# Altium project DAQ_Replacement.PrjPcb (part 1 of 3)
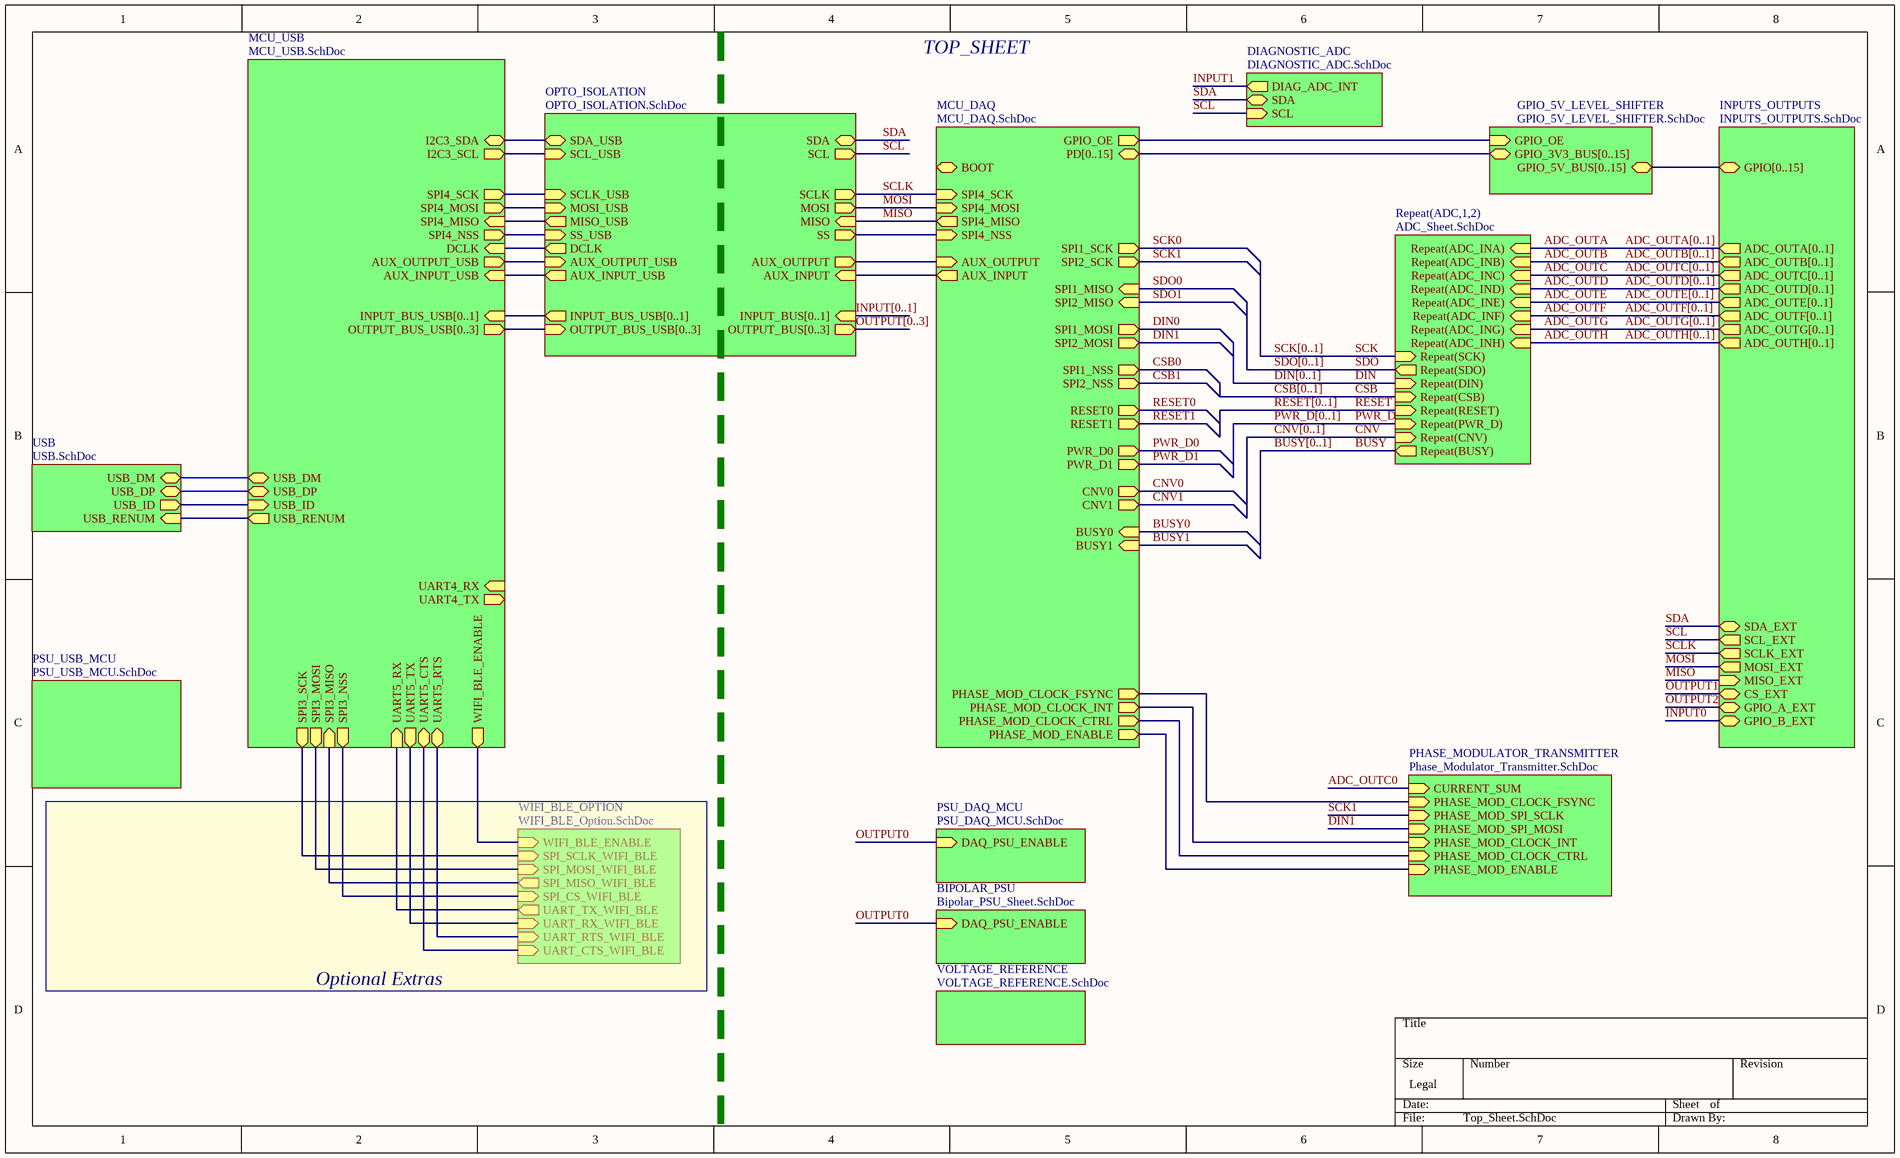
[diagram p0: Top_Sheet.SchDoc]
16 sheets, 448 parts. Net scope: hierarchical (ports join the sheet entries above them; power ports are global).
Board file: DAQ_Replacement.PcbDoc
Sheets:
  Top_Sheet.SchDoc
    USB = USB.SchDoc
    ADC1 = ADC_Sheet.SchDoc
      ADC_INPUT_FILTER = ADC_INPUT_FILTER.SchDoc
    ADC2 = ADC_Sheet.SchDoc
      ADC_INPUT_FILTER = ADC_INPUT_FILTER.SchDoc
    OPTO_ISOLATION = OPTO_ISOLATION.SchDoc
    BIPOLAR_PSU = Bipolar_PSU_Sheet.SchDoc
    WIFI_BLE_OPTION = WIFI_BLE_Option.SchDoc
    DIAGNOSTIC_ADC = DIAGNOSTIC_ADC.SchDoc
    MCU_DAQ = MCU_DAQ.SchDoc
    MCU_USB = MCU_USB.SchDoc
    PHASE_MODULATOR_TRANSMITTER = Phase_Modulator_Transmitter.SchDoc
    INPUTS_OUTPUTS = INPUTS_OUTPUTS.SchDoc
    GPIO_5V_LEVEL_SHIFTER = GPIO_5V_LEVEL_SHIFTER.SchDoc
    VOLTAGE_REFERENCE = VOLTAGE_REFERENCE.SchDoc
    PSU_USB_MCU = PSU_USB_MCU.SchDoc
    PSU_DAQ_MCU = PSU_DAQ_MCU.SchDoc

## Sheet Top_Sheet.SchDoc
size Legal

### Sub-sheets
BIPOLAR_PSU = Bipolar_PSU_Sheet.SchDoc: DAQ_PSU_ENABLE (in)
DIAGNOSTIC_ADC = DIAGNOSTIC_ADC.SchDoc: SCL (in), SDA (bidir), DIAG_ADC_INT (out)
GPIO_5V_LEVEL_SHIFTER = GPIO_5V_LEVEL_SHIFTER.SchDoc: GPIO_OE (in), GPIO_3V3_BUS[0..15] (bidir), GPIO_5V_BUS[0..15] (bidir)
INPUTS_OUTPUTS = INPUTS_OUTPUTS.SchDoc: SDA_EXT (bidir), SCL_EXT (out), SCLK_EXT (out), MOSI_EXT (out), MISO_EXT (in), GPIO_B_EXT, GPIO_A_EXT, GPIO[0..15] (bidir), CS_EXT, ADC_OUTA[0..1] (out), ADC_OUTB[0..1] (out), ADC_OUTC[0..1] (out), ADC_OUTD[0..1] (out), ADC_OUTE[0..1] (out), ADC_OUTF[0..1] (out), ADC_OUTG[0..1] (out), ADC_OUTH[0..1] (out)
MCU_DAQ = MCU_DAQ.SchDoc: BOOT, SPI4_NSS (in), SPI4_SCK (in), SPI4_MISO (out), SPI4_MOSI (in), SPI1_NSS (out), SPI1_SCK (out), SPI1_MISO (in), SPI1_MOSI (out), SPI2_NSS (out), SPI2_SCK (out), SPI2_MISO (in), SPI2_MOSI (out), PD[0..15] (bidir), CNV0 (out), RESET0 (out), BUSY0 (in), CNV1 (out), RESET1 (out), BUSY1 (in), PHASE_MOD_CLOCK_FSYNC (out), PHASE_MOD_CLOCK_INT (out), PHASE_MOD_CLOCK_CTRL (out), PHASE_MOD_ENABLE (out), AUX_INPUT (out), AUX_OUTPUT (in), GPIO_OE (out), PWR_D0 (out), PWR_D1 (out)
MCU_USB = MCU_USB.SchDoc: USB_ID (in), USB_RENUM (out), WIFI_BLE_ENABLE (out), DCLK (in), AUX_OUTPUT_USB (out), AUX_INPUT_USB (in), USB_DP (bidir), USB_DM (bidir), SPI4_NSS (out), SPI4_SCK (out), SPI4_MISO (in), SPI4_MOSI (out), UART5_CTS (bidir), UART5_RTS (bidir), SPI3_MOSI (out), SPI3_MISO (in), SPI3_NSS (out), SPI3_SCK (out), UART4_RX (in), UART4_TX (out), UART5_RX (in), UART5_TX (out), I2C3_SDA (bidir), I2C3_SCL (out), INPUT_BUS_USB[0..1] (in), OUTPUT_BUS_USB[0..3] (out)
OPTO_ISOLATION = OPTO_ISOLATION.SchDoc: SCL_USB (in), SDA_USB (bidir), SDA (bidir), SCLK_USB (in), MOSI_USB (in), MISO_USB (out), MISO (in), SS_USB (in), SS (out), DCLK (out), AUX_OUTPUT_USB (in), AUX_OUTPUT (out), AUX_INPUT_USB (out), AUX_INPUT (in), INPUT_BUS_USB[0..1] (out), OUTPUT_BUS_USB[0..3] (in), INPUT_BUS[0..1] (in), OUTPUT_BUS[0..3] (out), SCLK (out), MOSI (out), SCL (out)
PHASE_MODULATOR_TRANSMITTER = Phase_Modulator_Transmitter.SchDoc: CURRENT_SUM (in), PHASE_MOD_CLOCK_FSYNC (in), PHASE_MOD_SPI_SCLK (in), PHASE_MOD_SPI_MOSI (in), PHASE_MOD_ENABLE (in), PHASE_MOD_CLOCK_INT (in), PHASE_MOD_CLOCK_CTRL (in)
PSU_DAQ_MCU = PSU_DAQ_MCU.SchDoc: DAQ_PSU_ENABLE (in)
PSU_USB_MCU = PSU_USB_MCU.SchDoc: no entries
Repeat(ADC,1,2) = ADC_Sheet.SchDoc: Repeat(SCK) (in), Repeat(SDO) (out), Repeat(DIN) (in), Repeat(CNV) (in), Repeat(RESET) (in), Repeat(PWR_D) (in), Repeat(CSB) (in), Repeat(BUSY) (out), Repeat(ADC_INF) (in), Repeat(ADC_INB) (in), Repeat(ADC_INH) (in), Repeat(ADC_INC) (in), Repeat(ADC_INA) (in), Repeat(ADC_INE) (in), Repeat(ADC_IND) (in), Repeat(ADC_ING) (in)
USB = USB.SchDoc: USB_DM (bidir), USB_DP (bidir), USB_ID (out), USB_RENUM (in)
VOLTAGE_REFERENCE = VOLTAGE_REFERENCE.SchDoc: no entries
WIFI_BLE_OPTION = WIFI_BLE_Option.SchDoc: SPI_CS_WIFI_BLE (in), SPI_MOSI_WIFI_BLE (in), SPI_MISO_WIFI_BLE (out), SPI_SCLK_WIFI_BLE (in), UART_RX_WIFI_BLE (in), UART_TX_WIFI_BLE (out), UART_RTS_WIFI_BLE (in), UART_CTS_WIFI_BLE (in), WIFI_BLE_ENABLE (in)

### Nets
ADC_OUTA: sheet Repeat(ADC,1,2)/Repeat(ADC_INA)
ADC_OUTB: sheet Repeat(ADC,1,2)/Repeat(ADC_INB)
ADC_OUTC: sheet Repeat(ADC,1,2)/Repeat(ADC_INC)
ADC_OUTD: sheet Repeat(ADC,1,2)/Repeat(ADC_IND)
ADC_OUTE: sheet Repeat(ADC,1,2)/Repeat(ADC_INE)
ADC_OUTF: sheet Repeat(ADC,1,2)/Repeat(ADC_INF)
ADC_OUTG: sheet Repeat(ADC,1,2)/Repeat(ADC_ING)
ADC_OUTH: sheet Repeat(ADC,1,2)/Repeat(ADC_INH)
BUSY: sheet Repeat(ADC,1,2)/Repeat(BUSY)
CNV: sheet Repeat(ADC,1,2)/Repeat(CNV)
CSB: sheet Repeat(ADC,1,2)/Repeat(CSB)
DIN: sheet Repeat(ADC,1,2)/Repeat(DIN)
DIN1: sheet MCU_DAQ/SPI2_MOSI, sheet PHASE_MODULATOR_TRANSMITTER/PHASE_MOD_SPI_MOSI  [project net DIN]
GPIO_OE: sheet MCU_DAQ/GPIO_OE, sheet GPIO_5V_LEVEL_SHIFTER/GPIO_OE
I2C3_SCL: sheet OPTO_ISOLATION/SCL_USB, sheet MCU_USB/I2C3_SCL
I2C3_SDA: sheet OPTO_ISOLATION/SDA_USB, sheet MCU_USB/I2C3_SDA
MISO: sheet OPTO_ISOLATION/MISO, sheet MCU_DAQ/SPI4_MISO, sheet INPUTS_OUTPUTS/MISO_EXT
MOSI: sheet OPTO_ISOLATION/MOSI, sheet MCU_DAQ/SPI4_MOSI, sheet INPUTS_OUTPUTS/MOSI_EXT
OUTPUT0: sheet BIPOLAR_PSU/DAQ_PSU_ENABLE, sheet PSU_DAQ_MCU/DAQ_PSU_ENABLE  [project net DAQ_PSU_ENABLE]
PC0: sheet MCU_DAQ/PHASE_MOD_CLOCK_CTRL, sheet PHASE_MODULATOR_TRANSMITTER/PHASE_MOD_CLOCK_CTRL
PC1: sheet MCU_DAQ/PHASE_MOD_CLOCK_INT, sheet PHASE_MODULATOR_TRANSMITTER/PHASE_MOD_CLOCK_INT
PC2: sheet MCU_DAQ/PHASE_MOD_ENABLE, sheet PHASE_MODULATOR_TRANSMITTER/PHASE_MOD_ENABLE
PC3: sheet MCU_DAQ/PHASE_MOD_CLOCK_FSYNC, sheet PHASE_MODULATOR_TRANSMITTER/PHASE_MOD_CLOCK_FSYNC
PE8: sheet OPTO_ISOLATION/AUX_INPUT, sheet MCU_DAQ/AUX_INPUT
PE9: sheet OPTO_ISOLATION/AUX_OUTPUT, sheet MCU_DAQ/AUX_OUTPUT
PE11: sheet OPTO_ISOLATION/SS, sheet MCU_DAQ/SPI4_NSS
PWR_D: sheet Repeat(ADC,1,2)/Repeat(PWR_D)
RESET: sheet Repeat(ADC,1,2)/Repeat(RESET)
SCK: sheet Repeat(ADC,1,2)/Repeat(SCK)
SCK1: sheet MCU_DAQ/SPI2_SCK, sheet PHASE_MODULATOR_TRANSMITTER/PHASE_MOD_SPI_SCLK  [project net PB13]
SCL: sheet OPTO_ISOLATION/SCL, sheet DIAGNOSTIC_ADC/SCL, sheet INPUTS_OUTPUTS/SCL_EXT
SCLK: sheet OPTO_ISOLATION/SCLK, sheet MCU_DAQ/SPI4_SCK, sheet INPUTS_OUTPUTS/SCLK_EXT  [project net PE12]
SDA: sheet OPTO_ISOLATION/SDA, sheet DIAGNOSTIC_ADC/SDA, sheet INPUTS_OUTPUTS/SDA_EXT
SDO: sheet Repeat(ADC,1,2)/Repeat(SDO)
SPI_CS_WIFI_BLE: sheet WIFI_BLE_OPTION/SPI_CS_WIFI_BLE, sheet MCU_USB/SPI3_NSS
SPI_MISO_WIFI_BLE: sheet WIFI_BLE_OPTION/SPI_MISO_WIFI_BLE, sheet MCU_USB/SPI3_MISO
SPI_MOSI_WIFI_BLE: sheet WIFI_BLE_OPTION/SPI_MOSI_WIFI_BLE, sheet MCU_USB/SPI3_MOSI
SPI_SCLK_WIFI_BLE: sheet WIFI_BLE_OPTION/SPI_SCLK_WIFI_BLE, sheet MCU_USB/SPI3_SCK
UART_CTS_WIFI_BLE: sheet WIFI_BLE_OPTION/UART_CTS_WIFI_BLE, sheet MCU_USB/UART5_CTS
UART_RTS_WIFI_BLE: sheet WIFI_BLE_OPTION/UART_RTS_WIFI_BLE, sheet MCU_USB/UART5_RTS
UART_RX_WIFI_BLE: sheet WIFI_BLE_OPTION/UART_RX_WIFI_BLE, sheet MCU_USB/UART5_TX
UART_TX_WIFI_BLE: sheet WIFI_BLE_OPTION/UART_TX_WIFI_BLE, sheet MCU_USB/UART5_RX
USB_ID: sheet USB/USB_ID, sheet MCU_USB/USB_ID
USB_RENUM: sheet USB/USB_RENUM, sheet MCU_USB/USB_RENUM
WIFI_BLE_ENABLE: sheet WIFI_BLE_OPTION/WIFI_BLE_ENABLE, sheet MCU_USB/WIFI_BLE_ENABLE
NetJ4_2: sheet USB/USB_DM, sheet MCU_USB/USB_DM
NetJ4_3: sheet USB/USB_DP, sheet MCU_USB/USB_DP
NetU14_40: sheet OPTO_ISOLATION/DCLK, sheet MCU_USB/DCLK
NetU14_42: sheet OPTO_ISOLATION/SS_USB, sheet MCU_USB/SPI4_NSS
NetU14_43: sheet OPTO_ISOLATION/SCLK_USB, sheet MCU_USB/SPI4_SCK
NetU14_44: sheet OPTO_ISOLATION/MISO_USB, sheet MCU_USB/SPI4_MISO
NetU14_45: sheet OPTO_ISOLATION/MOSI_USB, sheet MCU_USB/SPI4_MOSI
NetU14_95: sheet OPTO_ISOLATION/AUX_OUTPUT_USB, sheet MCU_USB/AUX_OUTPUT_USB
NetU14_96: sheet OPTO_ISOLATION/AUX_INPUT_USB, sheet MCU_USB/AUX_INPUT_USB

### Buses and harness runs
bus ADC_OUTA[0..1] = sheet INPUTS_OUTPUTS/ADC_OUTA[0..1]
bus ADC_OUTB[0..1] = sheet INPUTS_OUTPUTS/ADC_OUTB[0..1]
bus ADC_OUTC[0..1] = sheet INPUTS_OUTPUTS/ADC_OUTC[0..1]
bus ADC_OUTD[0..1] = sheet INPUTS_OUTPUTS/ADC_OUTD[0..1]
bus ADC_OUTE[0..1] = sheet INPUTS_OUTPUTS/ADC_OUTE[0..1]
bus ADC_OUTF[0..1] = sheet INPUTS_OUTPUTS/ADC_OUTF[0..1]
bus ADC_OUTG[0..1] = sheet INPUTS_OUTPUTS/ADC_OUTG[0..1]
bus ADC_OUTH[0..1] = sheet INPUTS_OUTPUTS/ADC_OUTH[0..1]
bus BUSY[0..1]
bus CNV[0..1]
bus CSB[0..1]
bus DIN[0..1]
bus INPUT[0..1] = sheet OPTO_ISOLATION/INPUT_BUS[0..1]
bus OUTPUT[0..3] = sheet OPTO_ISOLATION/OUTPUT_BUS[0..3]
bus PWR_D[0..1]
bus RESET[0..1]
bus SCK[0..1]
bus SDO[0..1]
bus sheet GPIO_5V_LEVEL_SHIFTER/GPIO_3V3_BUS[0..15] = sheet MCU_DAQ/PD[0..15]
bus sheet GPIO_5V_LEVEL_SHIFTER/GPIO_5V_BUS[0..15] = sheet INPUTS_OUTPUTS/GPIO[0..15]
bus sheet MCU_USB/INPUT_BUS_USB[0..1] = sheet OPTO_ISOLATION/INPUT_BUS_USB[0..1]
bus sheet MCU_USB/OUTPUT_BUS_USB[0..3] = sheet OPTO_ISOLATION/OUTPUT_BUS_USB[0..3]

### Notes on the sheet
- TOP_SHEET
- Optional Extras

## Sheet USB.SchDoc: USB
size A4; DocumentNumber: MB1137; Revision: B-01; SheetNumber: 4; SheetTotal: 6; Project: NUCLEO-XXXXZX
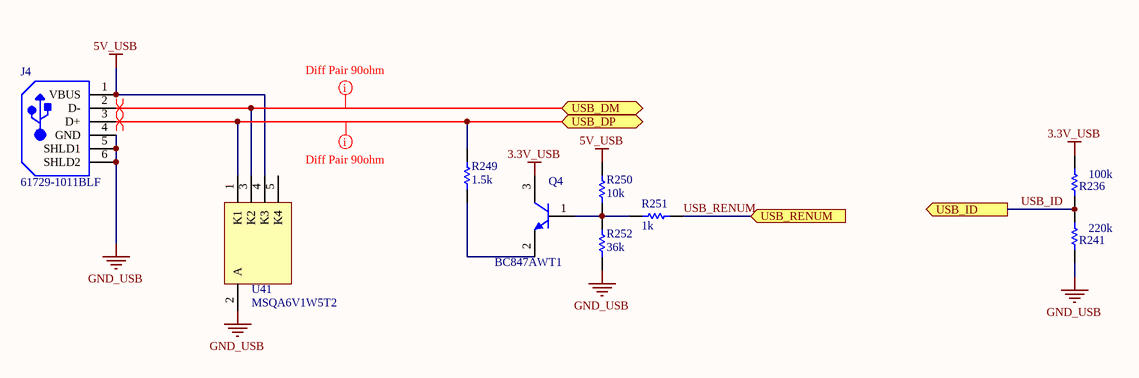
[diagram p1: USB.SchDoc]

### Parts
J4  61729-1011BLF  [FCI-61729-1011BLF_V]
Q4  BC847AWT1  [ONSC-SC-70-3-419-04_V]
R236  value 100k  [RESC0402(1005)_L]  (hidden comment: RES0402)
R241  value 220k  [RESC0402(1005)_L]  (hidden comment: RES0402)
R249  value 1.5k  [RESC0402(1005)_L]  (hidden comment: RES0402)
R250  value 10k  [RESC0402(1005)_L]  (hidden comment: RES0402)
R251  value 1k  [RESC0402(1005)_L]  (hidden comment: RES0402)
R252  value 36k  [RESC0402(1005)_L]  (hidden comment: RES0402)
U41  MSQA6V1W5T2  [ONSC-SC70-5-419A-02_V]

### Ports
USB_DM (bidir), USB_DP (bidir), USB_ID (out), USB_RENUM (in)

### Nets
3.3V_USB: Q4.3(C) R236.2
5V_USB: J4.1(VBUS) R250.1 U41.4(K3)
GND_USB: J4.4(GND) J4.5(SHLD1) J4.6(SHLD2) R241.1 R252.2 U41.2(A)
USB_ID: R236.1 R241.2 ; port USB_ID
USB_RENUM: R251.2 ; port USB_RENUM
NetJ4_2: J4.2(D-) U41.3(K2) ; port USB_DM
NetJ4_3: J4.3(D+) R249.1 U41.1(K1) ; port USB_DP
NetQ4_1: Q4.1(B) R250.2 R251.1 R252.1
NetQ4_2: Q4.2(E) R249.2

Not connected (* = marked no-connect by the designer): U41 5(K4)

### Layout directives
differential pair: (no net found under the mark)
mark named Diff Pair 90ohm: NetJ4_2, NetJ4_3

### Notes on the sheet
- Title:
- Project:
- Size:
- Date:
- A4
- Reference:
- Sheet:
- Revision:
- of

### Library data of the parts
J4 = CMP-1698-00004-1: USB Receptacle B Type, Right Angle, -40 to 85 degC, 4-Pin THD, RoHS, Tube; Voltage Rating (DC): 100 V; Case\Package: Radial; Capacitance: 22 uF; Tolerance: 20%; ComponentLink2Description: Datasheet; Lead Pitch: 2.5 mm; Packaging: Bulk; REACH SVHC: No SVHC; Length: 11.2 mm; Pins: 2; Radiation Hardening: No; RoHSCompliant: true; ComponentLink1Description: Manufacturer URL; Voltage Rating: 100 V; Min Operating Temperature: -40 degC; PackageDescription: 4-Pin Through Hole Device, Body 16 x 12.2 mm; Height: 11.2 mm; PackageReference: 61729-1011BLF; Package Quantity: 200; ComponentLink2URL: http://portal.fciconnect.com/Comergent/fci/drawing/61729.pdf; DatasheetVersion: Rev. W, 05/2014; Max Operating Temperature: 85 degC; Diameter: 6.3 mm; ComponentLink1URL: http://portal.fciconnect.com/; Mount: Through Hole
Q4 = CMP-1048-00334-1: General Purpose Transistor, NPN Silicon, 3-Pin SC70, Tape and Reel; Manufacturer: On Semiconductor; Note1: 0; fT Min (MHz): 100; IC Continuous (A): 0.1; PackageDescription: 3-Pin Small Outline Transistor, Body 2 x 1.25 mm, Pitch 0.65 mm; ComponentLink1Description: Manufacturer URL; ComponentLink2Description: Datasheet; ComponentLink1URL: http://www.onsemi.com/; ComponentLink2URL: http://www.onsemi.cn/pub_link/Collateral/BC846AWT1-D.PDF; Packing: Tape and Reel; DatasheetVersion: Rev. 9; Mounting Technology: Surface Mount; PartNumber: BC847AWT1; PackageVersion: Rev. N, 11/2008; RoHS: FALSE; ComponentLink3URL: http://www.onsemi.cn/pub_link/Collateral/419-04.PDF; Polarity: NPN; PackageReference: SC-70-3-419-04; ComponentLink3Description: Package Specification
R236 R241 R249-R252 = CMP-1591-00004-1: 0402 (1005 Metric) Chip Resistor; Case-EIA: 0402; Case-Metric: 1005; PackageReference: RESC0402(1005)
U41 = CMP-1060-00060-1: Quad Array ESD Protection Diodes with Low Clamping Voltage, 5-Pin SC70, Tape and Reel; Manufacturer: On Semiconductor; P Max (W): 0.385; Packing: Tape and Reel; DatasheetVersion: Rev. 7; ComponentLink2URL: http://www.onsemi.com/pub_link/Collateral/MSQA6V1W5T2-D.PDF; PackageDescription: 5-Pin Small Outline Transistor, Body 2 x 1.25 mm, Pitch 0.65 mm; PackageVersion: Rev. L, 01/2013; ComponentLink1URL: http://www.onsemi.com/; ComponentLink2Description: Datasheet; ComponentLink3Description: Package Specification; Mounting Technology: Surface Mount; ComponentLink1Description: Manufacturer URL; PackageReference: SC70-5-419A-02; PartNumber: MSQA6V1W5T2; ComponentLink3URL: http://www.onsemi.cn/pub_link/Collateral/419A-02.PDF

## Sheet ADC_Sheet.SchDoc
size A4
Used 2 times, as channels ADC1, ADC2. Parts and nets are listed once, with the designators drawn on the sheet.
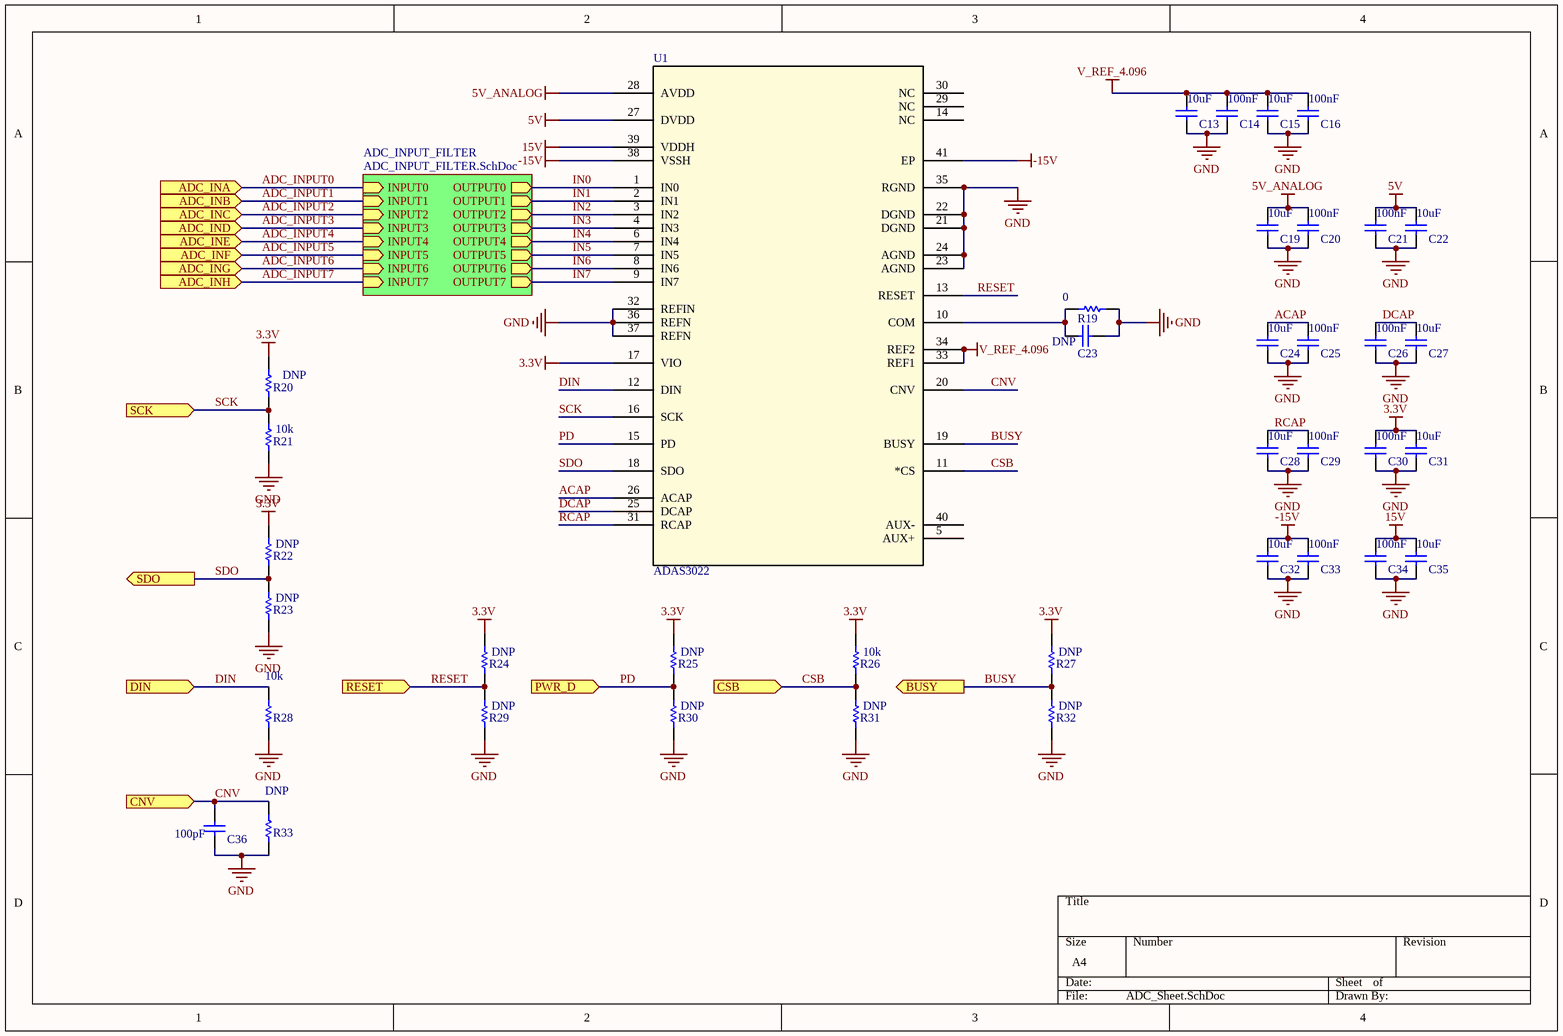
[diagram p2: ADC_Sheet.SchDoc]

### Parts
C13  value 10uF  [CAPC0805(2012)145_L]  (hidden comment: CAP0805)
C14  value 100nF  [CAPC0402(1005)60_L]  (hidden comment: CAP0402)
C15  value 10uF  [CAPC0805(2012)145_L]  (hidden comment: CAP0805)
C16  value 100nF  [CAPC0402(1005)60_L]  (hidden comment: CAP0402)
C19  value 10uF  [CAPC0805(2012)145_L]  (hidden comment: CAP0805)
C20  value 100nF  [CAPC0402(1005)60_L]  (hidden comment: CAP0402)
C21  value 100nF  [CAPC0402(1005)60_L]  (hidden comment: CAP0402)
C22  value 10uF  [CAPC0805(2012)145_L]  (hidden comment: CAP0805)
C23  value DNP  [CAPC0402(1005)60_L]  (hidden comment: CAP0402)
C24  value 10uF  [CAPC0805(2012)145_L]  (hidden comment: CAP0805)
C25  value 100nF  [CAPC0402(1005)60_L]  (hidden comment: CAP0402)
C26  value 100nF  [CAPC0402(1005)60_L]  (hidden comment: CAP0402)
C27  value 10uF  [CAPC0805(2012)145_L]  (hidden comment: CAP0805)
C28  value 10uF  [CAPC0805(2012)145_L]  (hidden comment: CAP0805)
C29  value 100nF  [CAPC0402(1005)60_L]  (hidden comment: CAP0402)
C30  value 100nF  [CAPC0402(1005)60_L]  (hidden comment: CAP0402)
C31  value 10uF  [CAPC0805(2012)145_L]  (hidden comment: CAP0805)
C32  value 10uF  [CAPC0805(2012)145_L]  (hidden comment: CAP0805)
C33  value 100nF  [CAPC0402(1005)60_L]  (hidden comment: CAP0402)
C34  value 100nF  [CAPC0402(1005)60_L]  (hidden comment: CAP0402)
C35  value 10uF  [CAPC0805(2012)145_L]  (hidden comment: CAP0805)
C36  value 100pF  [CAPC0402(1005)60_L]  (hidden comment: CAP0402)
R19  value 0  [RESC0402(1005)_L]  (hidden comment: RES0402)
R20  value DNP  [RESC0402(1005)_L]  (hidden comment: RES0402)
R21  value 10k  [RESC0402(1005)_L]  (hidden comment: RES0402)
R22  value DNP  [RESC0402(1005)_L]  (hidden comment: RES0402)
R23  value DNP  [RESC0402(1005)_L]  (hidden comment: RES0402)
R24  value DNP  [RESC0402(1005)_L]  (hidden comment: RES0402)
R25  value DNP  [RESC0402(1005)_L]  (hidden comment: RES0402)
R26  value 10k  [RESC0402(1005)_L]  (hidden comment: RES0402)
R27  value DNP  [RESC0402(1005)_L]  (hidden comment: RES0402)
R28  value 10k  [RESC0402(1005)_L]  (hidden comment: RES0402)
R29  value DNP  [RESC0402(1005)_L]  (hidden comment: RES0402)
R30  value DNP  [RESC0402(1005)_L]  (hidden comment: RES0402)
R31  value DNP  [RESC0402(1005)_L]  (hidden comment: RES0402)
R32  value DNP  [RESC0402(1005)_L]  (hidden comment: RES0402)
R33  value DNP  [RESC0402(1005)_L]  (hidden comment: RES0402)
U1  ADAS3022  [CP_40_7]

### Sub-sheets
ADC_INPUT_FILTER = ADC_INPUT_FILTER.SchDoc: INPUT0 (in), INPUT1 (in), INPUT2 (in), INPUT3 (in), INPUT4 (in), INPUT5 (in), INPUT6 (in), INPUT7 (in), OUTPUT0 (out), OUTPUT1 (out), OUTPUT2 (out), OUTPUT3 (out), OUTPUT4 (out), OUTPUT5 (out), OUTPUT6 (out), OUTPUT7 (out)

### Ports
ADC_INA (in), ADC_INB (in), ADC_INC (in), ADC_IND (in), ADC_INE (in), ADC_INF (in), ADC_ING (in), ADC_INH (in), BUSY (out), CNV (in), CSB (in), DIN (in), PWR_D (in), RESET (in), SCK (in), SDO (out)

### Nets
3.3V: C30.1 C31.2 R20.1 R22.1 R24.1 R25.1 R26.1 R27.1 U1.17(VIO)
5V: C21.1 C22.2 U1.27(DVDD)
5V_ANALOG: C19.2 C20.1 U1.28(AVDD)
15V: C34.1 C35.2 U1.39(VDDH)
-15V: C32.2 C33.1 U1.38(VSSH) U1.41(EP)
GND: C13.1 C14.2 C15.1 C16.2 C19.1 C20.2 C21.2 C22.1 C23.1 C24.1 C25.2 C26.2 C27.1 C28.1 C29.2 C30.2 C31.1 C32.1 C33.2 C34.2 C35.1 C36.2 R19.1 R21.2 R23.2 R28.2 R29.2 R30.2 R31.2 R32.2 R33.2 U1.21(DGND) U1.22(DGND) U1.23(AGND) U1.24(AGND) U1.32(REFIN) U1.35(RGND) U1.36(REFN) U1.37(REFN)
V_REF_4.096: C13.2 C14.1 C15.2 C16.1 U1.33(REF1) U1.34(REF2)
ACAP: C24.2 C25.1 U1.26(ACAP)
ADC_INPUT0: port ADC_INA, sheet ADC_INPUT_FILTER/INPUT0
ADC_INPUT1: port ADC_INB, sheet ADC_INPUT_FILTER/INPUT1
ADC_INPUT2: port ADC_INC, sheet ADC_INPUT_FILTER/INPUT2
ADC_INPUT3: port ADC_IND, sheet ADC_INPUT_FILTER/INPUT3
ADC_INPUT4: port ADC_INE, sheet ADC_INPUT_FILTER/INPUT4
ADC_INPUT5: port ADC_INF, sheet ADC_INPUT_FILTER/INPUT5
ADC_INPUT6: port ADC_ING, sheet ADC_INPUT_FILTER/INPUT6
ADC_INPUT7: port ADC_INH, sheet ADC_INPUT_FILTER/INPUT7
BUSY: R27.2 R32.1 U1.19(BUSY) ; port BUSY
CNV: C36.1 R33.1 U1.20(CNV) ; port CNV
CSB: R26.2 R31.1 U1.11(*CS) ; port CSB
DCAP: C26.1 C27.2 U1.25(DCAP)
DIN: R28.1 U1.12(DIN) ; port DIN
IN0: U1.1(IN0) ; sheet ADC_INPUT_FILTER/OUTPUT0
IN1: U1.2(IN1) ; sheet ADC_INPUT_FILTER/OUTPUT1
IN2: U1.3(IN2) ; sheet ADC_INPUT_FILTER/OUTPUT2
IN3: U1.4(IN3) ; sheet ADC_INPUT_FILTER/OUTPUT3
IN4: U1.6(IN4) ; sheet ADC_INPUT_FILTER/OUTPUT4
IN5: U1.7(IN5) ; sheet ADC_INPUT_FILTER/OUTPUT5
IN6: U1.8(IN6) ; sheet ADC_INPUT_FILTER/OUTPUT6
IN7: U1.9(IN7) ; sheet ADC_INPUT_FILTER/OUTPUT7
PD: R25.2 R30.1 U1.15(PD) ; port PWR_D
RCAP: C28.2 C29.1 U1.31(RCAP)
RESET: R24.2 R29.1 U1.13(RESET) ; port RESET
SCK: R20.2 R21.1 U1.16(SCK) ; port SCK
SDO: R22.2 R23.1 U1.18(SDO) ; port SDO
NetC23_2: C23.2 R19.2 U1.10(COM)

Not connected (* = marked no-connect by the designer): U1 5(AUX+) 14(NC) 29(NC) 30(NC) 40(AUX-)

### Channels
ADC1: designators end in _ADC1; ports ADC_INA=ADC_INPUT0 ADC_INB=ADC_INPUT1 ADC_INC=ADC_INPUT2 ADC_IND=ADC_INPUT3 ADC_INE=ADC_INPUT4 ADC_INF=ADC_INPUT5 ADC_ING=ADC_INPUT6 ADC_INH=ADC_INPUT7 BUSY=BUSY CNV=CNV CSB=CSB DIN=DIN PWR_D=PB8 RESET=PB7 SCK=PB13 SDO=PB14
ADC2: designators end in _ADC2; ports ADC_INA=ADC_INPUT0_ADC2 ADC_INB=ADC_INPUT1_ADC2 ADC_INC=ADC_INPUT2_ADC2 ADC_IND=ADC_INPUT3_ADC2 ADC_INE=ADC_INPUT4_ADC2 ADC_INF=ADC_INPUT5_ADC2 ADC_ING=ADC_INPUT6_ADC2 ADC_INH=ADC_INPUT7_ADC2 BUSY=BUSY_ADC2 CNV=CNV_ADC2 CSB=CSB_ADC2 DIN=DIN_ADC2 PWR_D=PD_ADC2 RESET=RESET_ADC2 SCK=SCK_ADC2 SDO=SDO_ADC2

### Library data of the parts
C13 C15 C19 C22 C24 C27 C28 C31 C32 C35 = CMP-1590-00003-1: 0805 (2012 Metric) Chip Capacitor; Case-EIA: 0805; Case-Metric: 2012; PackageReference: CAPC0805(2012)145
C14 C16 C20 C21 C23 C25 C26 C29 C30 C33 C34 C36 = CMP-1590-00004-1: 0402 (1005 Metric) Chip Capacitor; Case-EIA: 0402; Case-Metric: 1005; PackageReference: CAPC0402(1005)60
R19-R33 = CMP-1591-00004-1: as R236 on sheet USB; PackageReference: RESC0402(1005)
U1 = ADAS3022: Manufacturer: Analog Devices Inc.; Manufacturer Part Number: ADAS3022BCPZ; Number of Bits: 16; Sampling Rate (Per Second): 1M; Number of Inputs: 4, 8; Input Type: Differential, Single Ended; Data Interface: SPI; Configuration: MUX-PGA-ADC; Architecture: SAR; Reference Type: External, Internal; Voltage - Supply, Analog: 5V; Supplier 1: Digi-Key; RoHS: RoHS Compliant; Category: Integrated Circuits (ICs); Stock 1: 300; Pricing 1: 1=25.89, 10=23.878 (EUR); Packaging: Tray; Part Status: Active; Ratio - S/H:ADC: -; Voltage - Supply, Digital: 5V; Features: PGA, Temperature Sensor; Operating Temperature: -40°C ~ 85°C; Package / Case: 40-VFQFN Exposed Pad, CSP; Supplier Device Package: 40-LFCSP-VQ (6x6); Base Part Number: ADAS3022; ComponentLink1URL: http://www.analog.com/media/en/technical-documentation/data-sheets/ADAS3022.pdf; ComponentLink1Description: http://www.analog.com/media/en/technical-documentation/data-sheets/ADAS3022.pdf; Supplier Part Number 1: ADAS3022BCPZ-ND

## Sheet ADC_INPUT_FILTER.SchDoc
size A4
Used 2 times, as channels ADC1/ADC_INPUT_FILTER, ADC2/ADC_INPUT_FILTER. Parts and nets are listed once, with the designators drawn on the sheet.
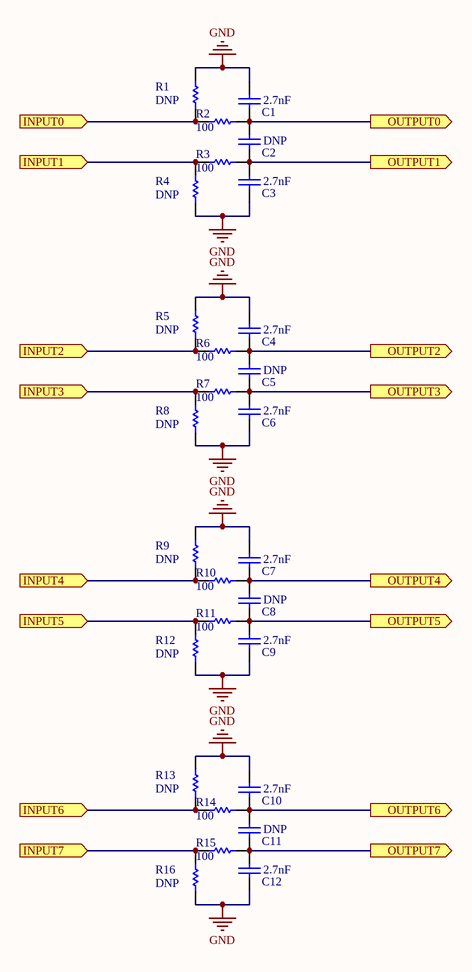
[diagram p3: ADC_INPUT_FILTER.SchDoc]

### Parts
C1  value 2.7nF  [CAPC0402(1005)60_L]  (hidden comment: CAP0402)
C2  value DNP  [CAPC0402(1005)60_L]  (hidden comment: CAP0402)
C3  value 2.7nF  [CAPC0402(1005)60_L]  (hidden comment: CAP0402)
C4  value 2.7nF  [CAPC0402(1005)60_L]  (hidden comment: CAP0402)
C5  value DNP  [CAPC0402(1005)60_L]  (hidden comment: CAP0402)
C6  value 2.7nF  [CAPC0402(1005)60_L]  (hidden comment: CAP0402)
C7  value 2.7nF  [CAPC0402(1005)60_L]  (hidden comment: CAP0402)
C8  value DNP  [CAPC0402(1005)60_L]  (hidden comment: CAP0402)
C9  value 2.7nF  [CAPC0402(1005)60_L]  (hidden comment: CAP0402)
C10  value 2.7nF  [CAPC0402(1005)60_L]  (hidden comment: CAP0402)
C11  value DNP  [CAPC0402(1005)60_L]  (hidden comment: CAP0402)
C12  value 2.7nF  [CAPC0402(1005)60_L]  (hidden comment: CAP0402)
R1  value DNP  [RESC0402(1005)_L]  (hidden comment: RES0402)
R2  value 100  [RESC0402(1005)_L]  (hidden comment: RES0402)
R3  value 100  [RESC0402(1005)_L]  (hidden comment: RES0402)
R4  value DNP  [RESC0402(1005)_L]  (hidden comment: RES0402)
R5  value DNP  [RESC0402(1005)_L]  (hidden comment: RES0402)
R6  value 100  [RESC0402(1005)_L]  (hidden comment: RES0402)
R7  value 100  [RESC0402(1005)_L]  (hidden comment: RES0402)
R8  value DNP  [RESC0402(1005)_L]  (hidden comment: RES0402)
R9  value DNP  [RESC0402(1005)_L]  (hidden comment: RES0402)
R10  value 100  [RESC0402(1005)_L]  (hidden comment: RES0402)
R11  value 100  [RESC0402(1005)_L]  (hidden comment: RES0402)
R12  value DNP  [RESC0402(1005)_L]  (hidden comment: RES0402)
R13  value DNP  [RESC0402(1005)_L]  (hidden comment: RES0402)
R14  value 100  [RESC0402(1005)_L]  (hidden comment: RES0402)
R15  value 100  [RESC0402(1005)_L]  (hidden comment: RES0402)
R16  value DNP  [RESC0402(1005)_L]  (hidden comment: RES0402)

### Ports
INPUT0 (in), INPUT1 (in), INPUT2 (in), INPUT3 (in), INPUT4 (in), INPUT5 (in), INPUT6 (in), INPUT7 (in), OUTPUT0 (out), OUTPUT1 (out), OUTPUT2 (out), OUTPUT3 (out), OUTPUT4 (out), OUTPUT5 (out), OUTPUT6 (out), OUTPUT7 (out)

### Nets
GND: C1.2 C3.1 C4.2 C6.1 C7.2 C9.1 C10.2 C12.1 R1.2 R4.1 R5.2 R8.1 R9.2 R12.1 R13.2 R16.1
INPUT0: R1.1 R2.1 ; port INPUT0
INPUT1: R3.1 R4.2 ; port INPUT1
INPUT2: R5.1 R6.1 ; port INPUT2
INPUT3: R7.1 R8.2 ; port INPUT3
INPUT4: R9.1 R10.1 ; port INPUT4
INPUT5: R11.1 R12.2 ; port INPUT5
INPUT6: R13.1 R14.1 ; port INPUT6
INPUT7: R15.1 R16.2 ; port INPUT7
OUTPUT0: C1.1 C2.2 R2.2 ; port OUTPUT0
OUTPUT1: C2.1 C3.2 R3.2 ; port OUTPUT1
OUTPUT2: C4.1 C5.2 R6.2 ; port OUTPUT2
OUTPUT3: C5.1 C6.2 R7.2 ; port OUTPUT3
OUTPUT4: C7.1 C8.2 R10.2 ; port OUTPUT4
OUTPUT5: C8.1 C9.2 R11.2 ; port OUTPUT5
OUTPUT6: C10.1 C11.2 R14.2 ; port OUTPUT6
OUTPUT7: C11.1 C12.2 R15.2 ; port OUTPUT7

### Channels
ADC1/ADC_INPUT_FILTER: designators end in _ADC1_ADC_INPUT_FILTER; ports INPUT0=ADC_INPUT0 INPUT1=ADC_INPUT1 INPUT2=ADC_INPUT2 INPUT3=ADC_INPUT3 INPUT4=ADC_INPUT4 INPUT5=ADC_INPUT5 INPUT6=ADC_INPUT6 INPUT7=ADC_INPUT7 OUTPUT0=IN0_ADC1 OUTPUT1=IN1_ADC1 OUTPUT2=IN2_ADC1 OUTPUT3=IN3_ADC1 OUTPUT4=IN4_ADC1 OUTPUT5=IN5_ADC1 OUTPUT6=IN6_ADC1 OUTPUT7=IN7_ADC1
ADC2/ADC_INPUT_FILTER: designators end in _ADC2_ADC_INPUT_FILTER; ports INPUT0=ADC_INPUT0_ADC2 INPUT1=ADC_INPUT1_ADC2 INPUT2=ADC_INPUT2_ADC2 INPUT3=ADC_INPUT3_ADC2 INPUT4=ADC_INPUT4_ADC2 INPUT5=ADC_INPUT5_ADC2 INPUT6=ADC_INPUT6_ADC2 INPUT7=ADC_INPUT7_ADC2 OUTPUT0=IN0_ADC2 OUTPUT1=IN1_ADC2 OUTPUT2=IN2_ADC2 OUTPUT3=IN3_ADC2 OUTPUT4=IN4_ADC2 OUTPUT5=IN5_ADC2 OUTPUT6=IN6_ADC2 OUTPUT7=IN7_ADC2

### Library data of the parts
C1-C12 = CMP-1590-00004-1: as C14 on sheet ADC_Sheet; PackageReference: CAPC0402(1005)60
R1-R16 = CMP-1591-00004-1: as R236 on sheet USB; PackageReference: RESC0402(1005)

## Sheet OPTO_ISOLATION.SchDoc
size A4
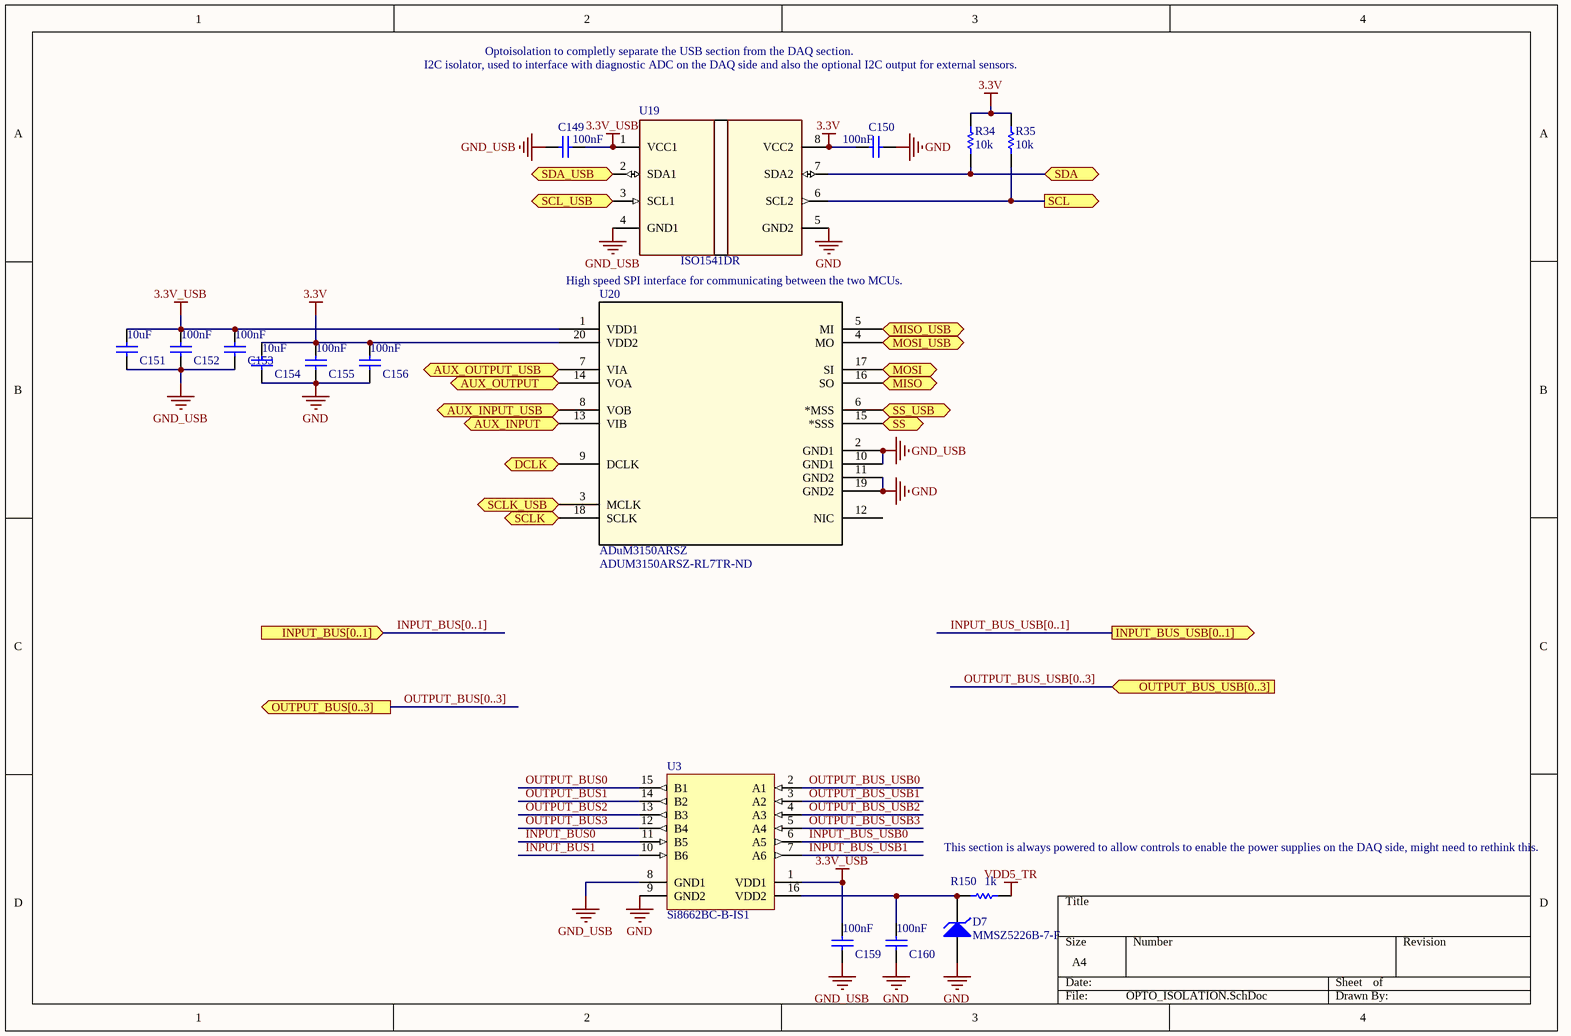
[diagram p4: OPTO_ISOLATION.SchDoc]

### Parts
C149  value 100nF  [CAPC0402(1005)60_L]  (hidden comment: CAP0402)
C150  value 100nF  [CAPC0402(1005)60_L]  (hidden comment: CAP0402)
C151  value 10uF  [CAPC0805(2012)145_L]  (hidden comment: CAP0805)
C152  value 100nF  [CAPC0402(1005)60_L]  (hidden comment: CAP0402)
C153  value 100nF  [CAPC0402(1005)60_L]  (hidden comment: CAP0402)
C154  value 10uF  [CAPC0805(2012)145_L]  (hidden comment: CAP0805)
C155  value 100nF  [CAPC0402(1005)60_L]  (hidden comment: CAP0402)
C156  value 100nF  [CAPC0402(1005)60_L]  (hidden comment: CAP0402)
C159  value 100nF  [CAPC0402(1005)60_L]  (hidden comment: CAP0402)
C160  value 100nF  [CAPC0402(1005)60_L]  (hidden comment: CAP0402)
D7  MMSZ5226B-7-F  [DIOD-SOD-123-2-A_V]
R34  value 10k  [RESC0402(1005)_L]  (hidden comment: RES0402)
R35  value 10k  [RESC0402(1005)_L]  (hidden comment: RES0402)
R150  value 1k  [RESC0603(1608)_L]  (hidden comment: RES0603)
U3  Si8662BC-B-IS1  [SLAB-SOIC-16-NB_N]
U19  ISO1541DR  [D0008A_N]
U20  ADuM3150ARSZ  Supplier Part Number 1: ADUM3150ARSZ-RL7TR-ND  [RS_20]

### Ports
AUX_INPUT (in), AUX_INPUT_USB (out), AUX_OUTPUT (out), AUX_OUTPUT_USB (in), DCLK (out), INPUT_BUS[0..1] (in), INPUT_BUS_USB[0..1] (out), MISO (in), MISO_USB (out), MOSI (out), MOSI_USB (in), OUTPUT_BUS[0..3] (out), OUTPUT_BUS_USB[0..3] (in), SCL (out), SCL_USB (in), SCLK (out), SCLK_USB (in), SDA (bidir), SDA_USB (bidir), SS (out), SS_USB (in)

### Nets
3.3V: C150.1 C154.2 C155.1 C156.1 R34.1 R35.1 U19.8(VCC2) U20.20(VDD2)
3.3V_USB: C149.2 C151.2 C152.1 C153.1 C159.1 U3.1(VDD1) U19.1(VCC1) U20.1(VDD1)
GND: C150.2 C154.1 C155.2 C156.2 C160.2 D7.1(A) U3.9(GND2) U19.5(GND2) U20.11(GND2) U20.19(GND2)
GND_USB: C149.1 C151.1 C152.2 C153.2 C159.2 U3.8(GND1) U19.4(GND1) U20.2(GND1) U20.10(GND1)
VDD5_TR: R150.2
I2C3_SCL: U19.3(SCL1) ; port SCL_USB
I2C3_SDA: U19.2(SDA1) ; port SDA_USB
INPUT_BUS0: U3.11(B5)  [project net INPUT0]
INPUT_BUS1: U3.10(B6)  [project net INPUT1]
INPUT_BUS_USB0: U3.6(A5)
INPUT_BUS_USB1: U3.7(A6)
MISO: U20.16(SO) ; port MISO
MOSI: U20.17(SI) ; port MOSI
OUTPUT_BUS0: U3.15(B1)  [project net DAQ_PSU_ENABLE]
OUTPUT_BUS1: U3.14(B2)  [project net OUTPUT1]
OUTPUT_BUS2: U3.13(B3)  [project net OUTPUT2]
OUTPUT_BUS3: U3.12(B4)  [project net OUTPUT3]
OUTPUT_BUS_USB0: U3.2(A1)  [project net DAQ_PSU_ENABLE]
OUTPUT_BUS_USB1: U3.3(A2)
OUTPUT_BUS_USB2: U3.4(A3)
OUTPUT_BUS_USB3: U3.5(A4)
PE8: U20.13(VIB) ; port AUX_INPUT
PE9: U20.14(VOA) ; port AUX_OUTPUT
PE11: U20.15(*SSS) ; port SS
PE12: U20.18(SCLK) ; port SCLK
SCL: R35.2 U19.6(SCL2) ; port SCL
SDA: R34.2 U19.7(SDA2) ; port SDA
NetC160_1: C160.1 D7.2(K) R150.1 U3.16(VDD2)
NetU14_40: U20.9(DCLK) ; port DCLK
NetU14_42: U20.6(*MSS) ; port SS_USB
NetU14_43: U20.3(MCLK) ; port SCLK_USB
NetU14_44: U20.5(MI) ; port MISO_USB
NetU14_45: U20.4(MO) ; port MOSI_USB
NetU14_95: U20.7(VIA) ; port AUX_OUTPUT_USB
NetU14_96: U20.8(VOB) ; port AUX_INPUT_USB

Not connected (* = marked no-connect by the designer): U20 12(NIC)

### Buses and harness runs
bus INPUT_BUS[0..1] = port INPUT_BUS[0..1]
bus INPUT_BUS_USB[0..1] = port INPUT_BUS_USB[0..1]
bus OUTPUT_BUS[0..3] = port OUTPUT_BUS[0..3]
bus OUTPUT_BUS_USB[0..3] = port OUTPUT_BUS_USB[0..3]

### Notes on the sheet
- I2C isolator, used to interface with diagnostic ADC on the DAQ side and also the optional I2C output for external sensors.
- Optoisolation to completly separate the USB section from the DAQ section.
- High speed SPI interface for communicating between the two MCUs.
- (near R150) This section is always powered to allow controls to enable the power supplies on the DAQ side, might need to rethink this.

### Library data of the parts
C149 C150 C152 C153 C155 C156 C159 C160 = CMP-1590-00004-1: as C14 on sheet ADC_Sheet; PackageReference: CAPC0402(1005)60
C151 C154 = CMP-1590-00003-1: as C13 on sheet ADC_Sheet; PackageReference: CAPC0805(2012)145
D7 = CMP-2000-06742-1: Zener Diode, 500 mW, 3.3 V, -65 to 150 degC, 2-Pin SOD123, RoHS, Tape and Reel; Vf - Forward Voltage: 0.9Vat10mA; Brand: DiodesIncorporated; Configuration: Single; Unit Weight: 0.000353oz; Voltage Tolerance: 5%; Pd - Power Dissipation: 500mW; Zener Current: 25uA; Vz - Zener Voltage: 3.3V; Zz - Zener Impedance: 28Ohms; Length: 3.85mm; Manufacturer: DiodesIncorporated; Height: 1.35mm; Mounting Style: SMD/SMT; Package / Case: SOD-123-2; Termination Style: SMD/SMT; Maximum Operating Temperature: +150C; Manufacturer URL: http://www.diodes.com/; Product: ZenerDiode; Factory Pack Quantity: 3000; Product Category: ZenerDiodes; Series: MMSZ522; RoHS: True; Package Reference: SOD-123-2; Datasheet Version: Rev. 27-2, 09/2012; Datasheet URL: http://www.diodes.com/_files/datasheets/ds18010.pdf; Width: 1.7mm; Mounting Technology: SurfaceMount; Ir - Reverse Current: 25uA; Packaging: Reel; Minimum Operating Temperature: -65C; Package Description: 2-Pin Small Outline Diode, Body 2.7 x 1.55 mm
R34 R35 = CMP-1591-00004-1: as R236 on sheet USB; PackageReference: RESC0402(1005)
R150 = CMP-1591-00001-1: 0603 (1608 Metric) Chip Resistor; Case-Metric: 1608; Case-EIA: 0603; PackageReference: RESC0603(1608)
U3 = CMP-0512-00153-1: Low Power Six-Channel Digital Isolator, 150 Mbps, 3.75 kVRMS Isolation Rating, -40 to 125 degC, 16-pin SOIC; Manufacturer: Silicon Labs; Enable Control: FALSE; Channel Type: Unidirectional; Isolation Rating (kV): 3.75; Maximum Propagation Delay (ns): 13; Maximum Data Rate (Mbps): 150; Sub-Family: Isolators; 10kV surge: FALSE; ComponentLink2URL: http://www.silabs.com/Support%20Documents/TechnicalDocs/Si866x.pdf; ComponentLink1URL: http://www.silabs.com/; DatasheetVersion: Rev. 1.4; ComponentLink3Description: Package Specification; ComponentLink2Description: Datasheet; ComponentLink1Description: Manufacturer URL; AEC-Q100: FALSE; PackageReference: SOIC-16-NB; PackageDescription: 16-Pin Small-Outline Integrated Circuit, Body 9.9 x 3.9 mm, Pitch 1.27 mm; Code_IPC: J-STD-020; PartNumber: Si8662BC-B-IS1; ComponentLink3URL: http://www.silabs.com/Support%20Documents/TechnicalDocs/si2401.pdf; Code_JEDEC: MS-012; Mounting Technology: Surface Mount
U19 = ISO1541DR: Imported; Manufacturer: Texas Instruments; CompType: IC; PIN_COUNT: 8; Isolated Power: No; Inputs - Side 1/Side 2: 2/1; Channel Type: Bidirectional, Unidirectional; Voltage - Isolation: 2500Vrms; Common Mode Transient Immunity (Min): 25kV/µs; Data Rate: 1Mbps; Pulse Width Distortion (Max): 80ns, 21ns; Voltage - Supply: 3 V ~ 5.5 V; PartNumber: ISO1541DR; Alternate_PartNumber: ISO1541D; PackageReference: D0008A; MountType: SMT; RoHS: Y; RefDes: RefDes; TYPE: TYPE; Value: Value; Supplier 1: Digi-Key; Manufacturer Part Number: ISO1541DR; Category: Isolators; Stock 1: 6204; Pricing 1: 1=3.62, 10=3.25, 100=2.6626, 500=2.2666, 1000=1.91159 (EUR); Packaging: Cut Tape (CT); Part Status: Active; Technology: Capacitive Coupling; Propagation Delay tpLH / tpHL (Max): -; Rise / Fall Time (Typ): -; Operating Temperature: -40°C ~ 125°C; Package / Case: 8-SOIC (0.154", 3.90mm Width); Supplier Device Package: 8-SOIC; ComponentLink1URL: http://www.ti.com/lit/ds/symlink/iso1541.pdf; ComponentLink1Description: http://www.ti.com/lit/ds/symlink/iso1541.pdf; Supplier Part Number 1: 296-34872-1-ND
U20 = ADuM3150ARSZ: Imported; Manufacturer: Analog Devices Inc.; Manufacturer Part Number: ADUM3150ARSZ-RL7; Isolated Power: No; Inputs - Side 1/Side 2: 4/2; Channel Type: Unidirectional; Voltage - Isolation: 3750Vrms; Common Mode Transient Immunity (Min): 25kV/µs; Data Rate: 40Mbps; Propagation Delay tpLH / tpHL (Max): 25ns, 25ns; Pulse Width Distortion (Max): 2ns; Rise / Fall Time (Typ): 2.5ns, 2.5ns; Voltage - Supply: 3 V ~ 5.5 V; Value: Value; Type: Type; RefDes: RefDes; Supplier 1: Digi-Key; RoHS: RoHS Compliant; Category: Isolators; Stock 1: 0; Pricing 1: 500=4.07462 (EUR); Packaging: Tape & Reel (TR); Part Status: Active; Technology: Magnetic Coupling; Operating Temperature: -40°C ~ 125°C; Package / Case: 20-SSOP (0.209", 5.30mm Width); Supplier Device Package: 20-SSOP; ComponentLink1URL: http://www.analog.com/media/en/technical-documentation/data-sheets/ADuM3150.pdf; ComponentLink1Description: http://www.analog.com/media/en/technical-documentation/data-sheets/ADuM3150.pdf

## Sheet Bipolar_PSU_Sheet.SchDoc
size A4
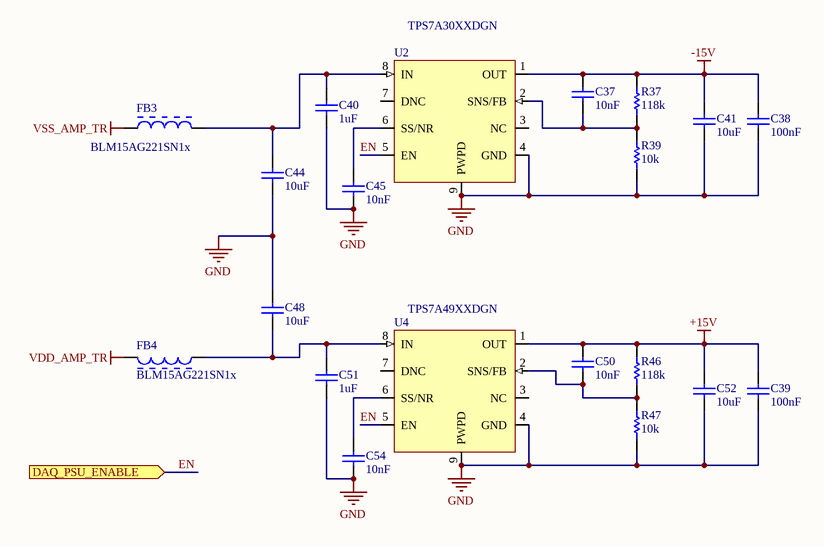
[diagram p5: Bipolar_PSU_Sheet.SchDoc]

### Parts
C37  value 10nF  [CAPC0402(1005)60_L]  (hidden comment: CAP0402)
C38  value 100nF  [CAPC0402(1005)60_L]  (hidden comment: CAP0402)
C39  value 100nF  [CAPC0402(1005)60_L]  (hidden comment: CAP0402)
C40  1uF  [0603]
C41  10uF  [C1206]
C44  10uF  [C1206]
C45  value 10nF  [CAPC0402(1005)60_L]  (hidden comment: CAP0402)
C48  10uF  [C1206]
C50  value 10nF  [CAPC0402(1005)60_L]  (hidden comment: CAP0402)
C51  1uF  [0603]
C52  10uF  [C1206]
C54  value 10nF  [CAPC0402(1005)60_L]  (hidden comment: CAP0402)
FB3  BLM15AG221SN1x  [MURA-BLM15AG221SN1x_V]
FB4  BLM15AG221SN1x  [MURA-BLM15AG221SN1x_V]
R37  value 118k  [RESC0402(1005)_L]  (hidden comment: RES0402)
R39  value 10k  [RESC0402(1005)_L]  (hidden comment: RES0402)
R46  value 118k  [RESC0402(1005)_L]  (hidden comment: RES0402)
R47  value 10k  [RESC0402(1005)_L]  (hidden comment: RES0402)
U2  TPS7A30XXDGN  [DGN-8]
U4  TPS7A49XXDGN  [DGN-8]

### Ports
DAQ_PSU_ENABLE (in)

### Nets
+15V: C39.2 C50.2 C52.2 R46.2 U4.1(OUT)
-15V: C37.2 C38.2 C41.2 R37.2 U2.1(OUT)
GND: C38.1 C39.1 C40.1 C41.1 C44.1 C45.1 C48.2 C51.1 C52.1 C54.1 R39.1 R47.1 U2.4(GND) U2.9(PWPD) U4.4(GND) U4.9(PWPD)
VDD_AMP_TR: FB4.2
VSS_AMP_TR: FB3.1
EN: U2.5(EN) U4.5(EN) ; port DAQ_PSU_ENABLE  [project net DAQ_PSU_ENABLE]
NetC37_1: C37.1 R37.1 R39.2 U2.2(SNS/FB)
NetC40_2: C40.2 C44.2 FB3.2 U2.8(IN)
NetC45_2: C45.2 U2.6(SS/NR)
NetC48_1: C48.1 C51.2 FB4.1 U4.8(IN)
NetC50_1: C50.1 R46.1 R47.2 U4.2(SNS/FB)
NetC54_2: C54.2 U4.6(SS/NR)

Not connected (* = marked no-connect by the designer): U2 3(NC) 7(DNC); U4 3(NC) 7(DNC)

### Library data of the parts
C37-C39 C45 C50 C54 = CMP-1590-00004-1: as C14 on sheet ADC_Sheet; PackageReference: CAPC0402(1005)60
C40 C51 = C_0603_1uF_25V_CER: Capacitor; Manufacturer Part Number: 0603X105K250CT; Voltage Rating: 25V; Unit Cost: .02; Supplier 1: Farnell; Supplier Part Number 1: 2496918; ComponentLinkURL1: http://ie.farnell.com/walsin/0603x105k6r3ct/capacitor-mlcc-x5r-1uf-6-3v-0603/dp/2496919; Value: 1uF
C41 C44 C48 C52 = C_1206_10uF_25V_CER: Capacitor; Manufacturer Part Number: 1206X106K250CT; Voltage Rating: 25V; Unit Cost: .07; Supplier 1: Farnell; Supplier Part Number 1: 2497152RL; ComponentLinkURL1: http://ie.farnell.com/walsin/1206x106k250ct/capacitor-mlcc-x5r-10uf-25v-1206/dp/2497152RL; Value: 10uF
FB3 FB4 = CMP-1662-00018-3: Chip Bead, 220 Ohm, +/- 25 %, 100 MHz, 300 mA, -55 to 125 degC, 0402 (1005 Metric), RoHS; Tolerance: 25%; Current Rating: 200 mA; Max Current Rating: 450 mA; Resistance: 220 Ohm; Package Quantity: 10000; DatasheetVersion: 03/2011; Radiation Hardening: No; Case Code (Imperial): 0402; Length: 1 mm; RoHSCompliant: True; ComponentLink1URL: http://www.murata.com/; Case/Package: 0402; Width: 0.5 mm; Mounting Technology: Surface Mount; REACH SVHC: No SVHC; Height: 0.5 mm; ComponentLink2Description: Datasheet; PartNumber: BLM15AG221SN1x; ComponentLink1Description: Manufacturer URL; Max Operating Temperature: 125 degC; PackageDescription: 2-Pin Surface Mount Device, Body 1 x 0.5 mm; Case Code (Metric): 1005; ComponentLink2URL: https://datasheet.ciiva.com/11800/0900766b811b5866-11800858.pdf; Min Operating Temperature: -55 degC
R37 R39 R46 R47 = CMP-1591-00004-1: as R236 on sheet USB; PackageReference: RESC0402(1005)
U2 = TPS7A30XXDGN: IC, -3V to -36V, -200mA, Ultralow Noise, High-PSRR LDO Negative Linear Regulator; Alternate Manufacturer: None; Manufacturer: TI; PartNumber: TPS7A3001DGNT; Area: 35250; Unit Cost: 3.95; Alternate PartNumber: *; Altium Migration: *; ComponentHeight: 0.047; ComponentLink1Description: AEO Datasheet Link; ComponentLink1URL: http://ie.farnell.com/texas-instruments/tps7a3001dgnt/ic-ldo-neg-adj-200ma-8msop/dp/1855138; PackageReference: MSOP-8; SymbolVersion: 10/28/2009 14:24; Value: *; Supplier 1: Farnell; Supplier Part Number 1: 1855138
U4 = TPS7A49XXDGN: IC, 3V to 36V, 150mA, Ultralow Noise, High-PSRR LDO Positive Linear Regulator; Alternate Manufacturer: None; Manufacturer: TI; PartNumber: TPS7A4901DGNT; Area: 35250; Value: TPS7A4901DGNT; Unit Cost: 2.64; Alternate PartNumber: *; Altium Migration: *; ComponentHeight: 0.047; ComponentLink1Description: AEO Datasheet Link; ComponentLink1URL: http://ie.farnell.com/texas-instruments/tps7a4901dgnt/ic-ldo-adj-150ma-8msop/dp/1841881; PackageReference: MSOP-8; SymbolVersion: 10/28/2009 14:24; Supplier 1: Farnell; Supplier Part Number 1: 1841881

## Sheet WIFI_BLE_Option.SchDoc
size A4
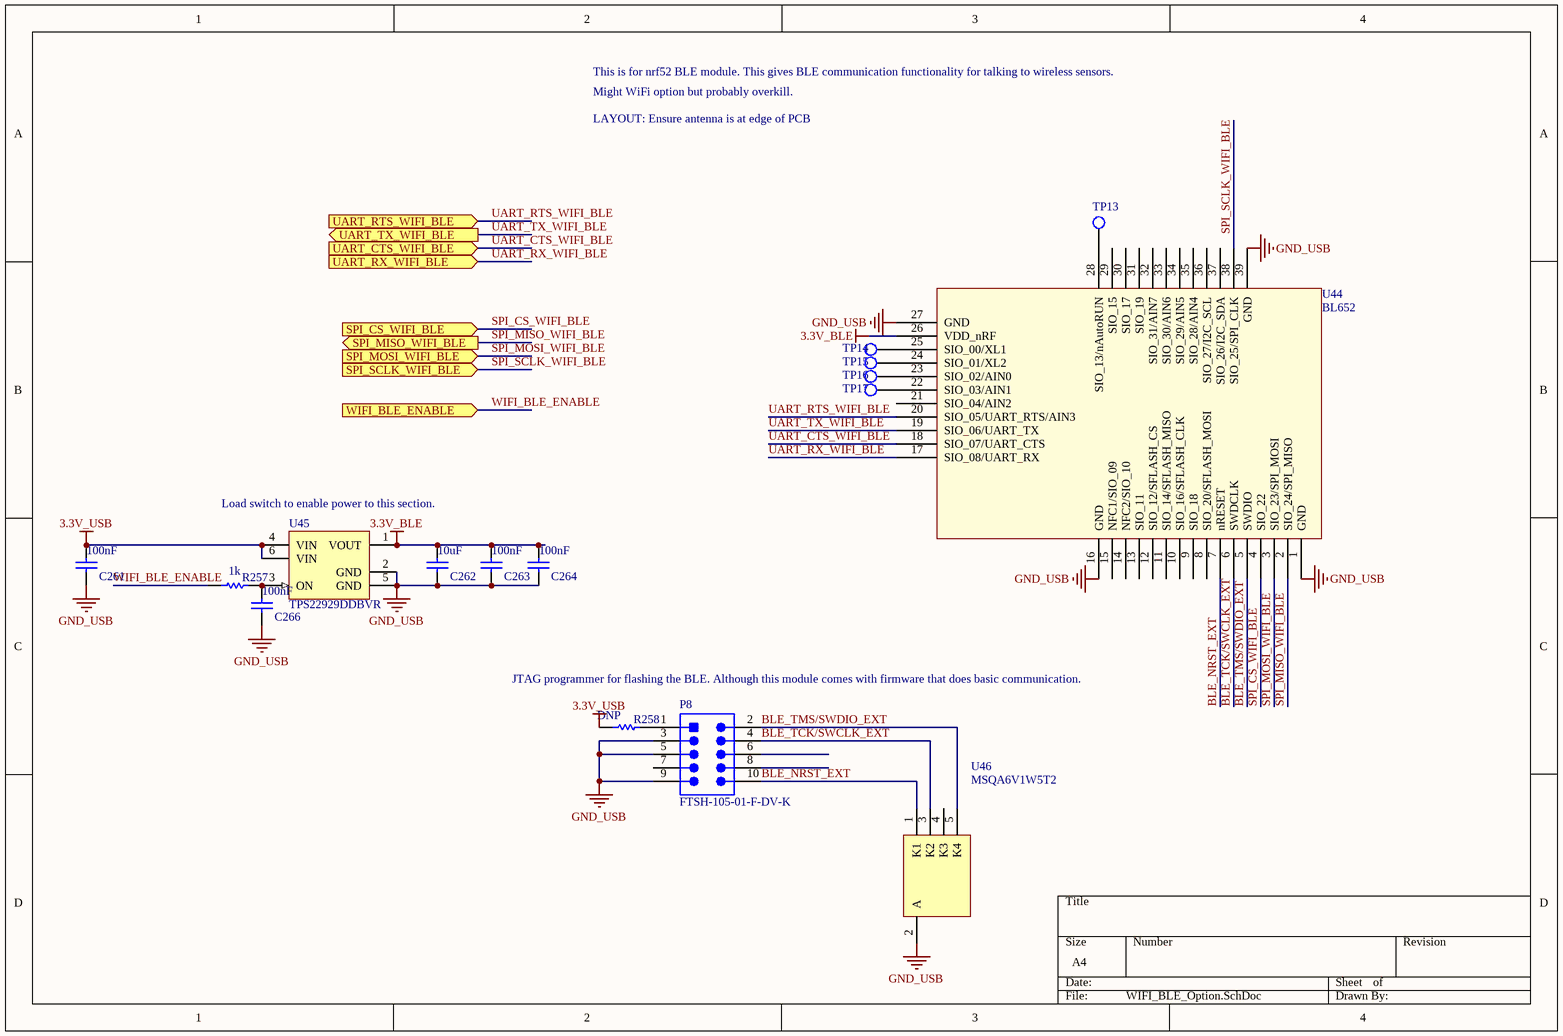
[diagram p6: WIFI_BLE_Option.SchDoc]

### Parts
C261  value 100nF  [CAPC0402(1005)60_L]  (hidden comment: CAP0402)
C262  value 10uF  [CAPC0805(2012)145_L]  (hidden comment: CAP0805)
C263  value 100nF  [CAPC0402(1005)60_L]  (hidden comment: CAP0402)
C264  value 100nF  [CAPC0402(1005)60_L]  (hidden comment: CAP0402)
C266  value 100nF  [CAPC0402(1005)60_L]  (hidden comment: CAP0402)
P8  FTSH-105-01-F-DV-K  [SMTC-FTSH-105-01-L-DV-K_V]
R257  value 1k  [RESC0402(1005)_L]  (hidden comment: RES0402)
R258  value DNP  [RESC0402(1005)_L]  (hidden comment: RES0402)
TP13  Test Point  [Test_Point]  (value not drawn)
TP14  Test Point  [Test_Point]  (value not drawn)
TP15  Test Point  [Test_Point]  (value not drawn)
TP16  Test Point  [Test_Point]  (value not drawn)
TP17  Test Point  [Test_Point]  (value not drawn)
U44  BL652  [BL652]
U45  TPS22929DDBVR  [DBV6_N]
U46  MSQA6V1W5T2  [ONSC-SC70-5-419A-02_V]

### Ports
SPI_CS_WIFI_BLE (in), SPI_MISO_WIFI_BLE (out), SPI_MOSI_WIFI_BLE (in), SPI_SCLK_WIFI_BLE (in), UART_CTS_WIFI_BLE (in), UART_RTS_WIFI_BLE (in), UART_RX_WIFI_BLE (in), UART_TX_WIFI_BLE (out), WIFI_BLE_ENABLE (in)

### Nets
3.3V_BLE: C262.2 C263.1 C264.1 U44.26(VDD_nRF) U45.1(VOUT)
3.3V_USB: C261.1 R258.2 U45.4(VIN) U45.6(VIN)
GND_USB: C261.2 C262.1 C263.2 C264.2 C266.2 P8.3 P8.5 P8.9 U44.1(GND) U44.16(GND) U44.27(GND) U44.39(GND) U45.2(GND) U45.5(GND) U46.2(A)
BLE_NRST_EXT: P8.10 U44.7(nRESET) U46.1(K1)
BLE_TCK/SWCLK_EXT: P8.4 U44.6(SWDCLK) U46.3(K2)
BLE_TMS/SWDIO_EXT: P8.2 U44.5(SWDIO) U46.5(K4)
SPI_CS_WIFI_BLE: U44.4(SIO_22) ; port SPI_CS_WIFI_BLE
SPI_MISO_WIFI_BLE: U44.2(SIO_24/SPI_MISO) ; port SPI_MISO_WIFI_BLE
SPI_MOSI_WIFI_BLE: U44.3(SIO_23/SPI_MOSI) ; port SPI_MOSI_WIFI_BLE
SPI_SCLK_WIFI_BLE: U44.38(SIO_25/SPI_CLK) ; port SPI_SCLK_WIFI_BLE
UART_CTS_WIFI_BLE: U44.18(SIO_07/UART_CTS) ; port UART_CTS_WIFI_BLE
UART_RTS_WIFI_BLE: U44.20(SIO_05/UART_RTS/AIN3) ; port UART_RTS_WIFI_BLE
UART_RX_WIFI_BLE: U44.17(SIO_08/UART_RX) ; port UART_RX_WIFI_BLE
UART_TX_WIFI_BLE: U44.19(SIO_06/UART_TX) ; port UART_TX_WIFI_BLE
WIFI_BLE_ENABLE: R257.2 ; port WIFI_BLE_ENABLE
NetC266_1: C266.1 R257.1 U45.3(ON)
NetP8_1: P8.1 R258.1
NetTP13_1: TP13.1(TP) U44.28(SIO_13/nAutoRUN)
NetTP14_1: TP14.1(TP) U44.25(SIO_00/XL1)
NetTP15_1: TP15.1(TP) U44.24(SIO_01/XL2)
NetTP16_1: TP16.1(TP) U44.23(SIO_02/AIN0)
NetTP17_1: TP17.1(TP) U44.22(SIO_03/AIN1)

Not connected (* = marked no-connect by the designer): P8 6 7 8; U44 8(SIO_20/SFLASH_MOSI) 9(SIO_18) 10(SIO_16/SFLASH_CLK) 11(SIO_14/SFLASH_MISO) 12(SIO_12/SFLASH_CS) 13(SIO_11) 14(NFC2/SIO_10) 15(NFC1/SIO_09) 21(SIO_04/AIN2) 29(SIO_15) 30(SIO_17) 31(SIO_19) 32(SIO_31/AIN7) 33(SIO_30/AIN6) 34(SIO_29/AIN5) 35(SIO_28/AIN4) 36(SIO_27/I2C_SCL) 37(SIO_26/I2C_SDA); U46 4(K3)

### Notes on the sheet
- This is for nrf52 BLE module. This gives BLE communication functionality for talking to wireless sensors.
- Might WiFi option but probably overkill.
- LAYOUT: Ensure antenna is at edge of PCB
- Load switch to enable power to this section.
- JTAG programmer for flashing the BLE. Although this module comes with firmware that does basic communication.

### Library data of the parts
C261 C263 C264 C266 = CMP-1590-00004-1: as C14 on sheet ADC_Sheet; PackageReference: CAPC0402(1005)60
C262 = CMP-1590-00003-1: as C13 on sheet ADC_Sheet; PackageReference: CAPC0805(2012)145
P8 = CMP-2000-05352-1: Male Header, Pitch 1.27 mm, 2 x 5 Position, Height 6.12 mm, RoHS, Tube; Manufacturer: Samtec; Number of Positions: 10; Connector Type: Header,Shrouded; Number of Positions Loaded: All; Row Spacing: 0.050"(1.27mm); Fastening Type: -; Package Reference: FTSH-105-01-L-DV-K; Termination: Solder; Package URL: http://suddendocs.samtec.com/prints/ftsh-1xx-xx-xxx-dv-xxx-footprint.pdf; Number of Rows: 2; Contact Finish Thickness: 3µin(0.08µm); Contact Type: MalePin; Manufacturer URL: http://www.samtec.com/; Contact Mating Length: 0.120"(3.05mm); Pitch: 0.050"(1.27mm); Series: FTSH; Features: -; Contact Finish: Gold; Color: Black; Family: RectangularConnectors-Headers,MalePins; Datasheet URL: http://suddendocs.samtec.com/prints/ftsh-1xx-xx-xxx-dv-xxx-mkt.pdf; Package Description: Male Header, Pitch 1.27 mm, 2 x 5 Position, Height 5.97 mm, Tail Length 4.32 mm; Mounting Type: SurfaceMount; Datasheet Version: Rev. ET, 10/1995; Category: Connectors,Interconnects; Packaging: Tube
R257 R258 = CMP-1591-00004-1: as R236 on sheet USB; PackageReference: RESC0402(1005)
TP13-TP17 = Test_Point: HARWIN  S1751-46R  PCB Test Point, S1751 Series, Surface Mount, Copper Alloy, Tin Plated Contacts; Unit Cost: 0.129; ComponentLnkURL1: http://ie.farnell.com/harwin/s1751-46r/test-point-pcb-smt/dp/2293786?ost=2293786&selectedCategoryId=&categoryNameResp=All%2BCategories&searchView=table&iscrfnonsku=false; Manufacturer: HARWIN; Manufacturer Part Number: S1751-46R; Supplier 1: Farnell; Supplier Part Number 1: 2293786; Value: *
U44 = BL652: Manufacturer: Laird - Wireless & Thermal Systems; Manufacturer Part Number: BL652-SA-01-T/R; Utilized IC / Part: nRF52832; RF Family/Standard: Bluetooth; Protocol: Bluetooth v4.2; Frequency: 2.4GHz; Data Rate: 1Mbps; Power - Output: 4dBm; Sensitivity: -96dBm; Serial Interfaces: I²C, SPI, UART; Antenna Type: Integrated, Chip; Memory Size: 512kB Flash, 64kB RAM; Voltage - Supply: 1.7 V ~ 3.6 V; Current - Receiving: 5.4mA; Current - Transmitting: 5.3mA; Supplier 1: Digi-Key; RoHS: RoHS Compliant; Category: RF/IF and RFID; Stock 1: 12877; Pricing 1: 1=6.04 (EUR); Packaging: Cut Tape (CT); Part Status: Active; Modulation: -; Mounting Type: Surface Mount; Operating Temperature: -40°C ~ 85°C; Package / Case: 39-SMD Module; ComponentLink1URL: http://assets.lairdtech.com/home/brandworld/files/Datasheet%20-%20BL652.pdf; ComponentLink1Description: http://assets.lairdtech.com/home/brandworld/files/Datasheet%20-%20BL652.pdf; Supplier Part Number 1: BL652-SA-01-CT-ND
U45 = CMP-0330-00011-1: Low Input Voltage, 1.8 A Single Channel Load Switch with Controlled Turn-On, 1.8 V Logic Compatible, 1.8 A, 1.4 to 5.5 V, -40 to 85 degC, 6-pin SOT-23 (DBV), Green (RoHS & no Sb/Br); Manufacturer: Texas Instruments; Quick Output Discharge Transistor: Yes; SubFamily: Non Current Limited Load Switch; Iin(nA): 10000; Control Logic: 1.8-V Logic Compatible; HBM ESD(kV): 2; Vin(V): 1.4 - 5.5; Active High Enable: TRUE; Output Rise Time(ÂµS): 4500; Imax(A): 1.8; rON @1.8V(mOhm): 85; PartNumber: TPS22929DDBVR; Eco-Plan: Green (RoHS & no Sb/Br); ComponentLink1Description: Datasheet; DatasheetVersion: SLVSB39; PackageReference: DBV6; PackageVersion: revK, Mar-2006; PackageDescription: 6-Pin Plastic Small-Outline Package, 2.9 x 1.6 mm Body, 0.95 mm Pitch, 2.8 mm Lead Span; ComponentLink1URL: http://www.ti.com/general/docs/lit/getliterature.tsp?genericPartNumber=TPS22929D&fileType=pdf; Code_JEDEC: MO-178-AB*; Mounting Technology: Surface Mount
U46 = CMP-1060-00060-1: as U41 on sheet USB; Packing: Tape and Reel; DatasheetVersion: Rev. 7; ComponentLink2URL: http://www.onsemi.com/pub_link/Collateral/MSQA6V1W5T2-D.PDF; PackageDescription: 5-Pin Small Outline Transistor, Body 2 x 1.25 mm, Pitch 0.65 mm; PackageVersion: Rev. L, 01/2013; ComponentLink1URL: http://www.onsemi.com/; ComponentLink2Description: Datasheet; ComponentLink3Description: Package Specification; Mounting Technology: Surface Mount; ComponentLink1Description: Manufacturer URL; PackageReference: SC70-5-419A-02; PartNumber: MSQA6V1W5T2; ComponentLink3URL: http://www.onsemi.cn/pub_link/Collateral/419A-02.PDF

## Sheet DIAGNOSTIC_ADC.SchDoc
size A4
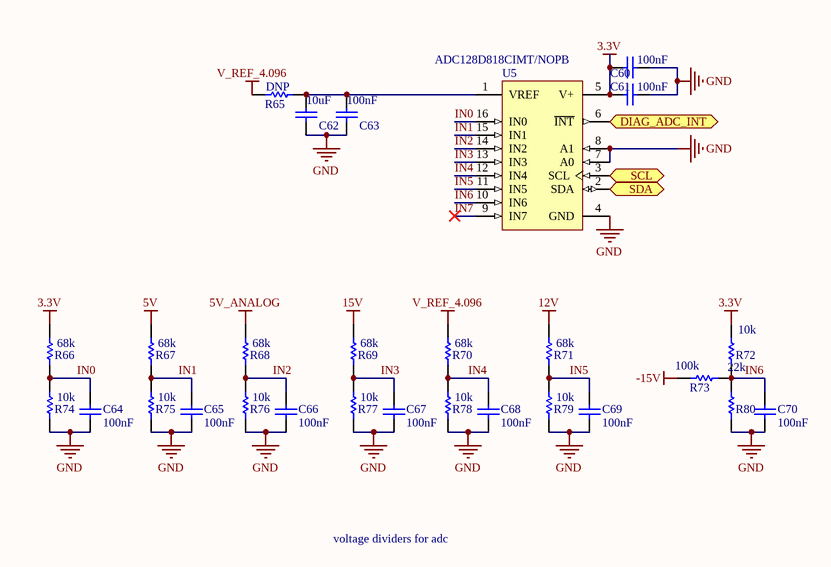
[diagram p7: DIAGNOSTIC_ADC.SchDoc]

### Parts
C60  value 100nF  [CAPC0402(1005)60_L]  (hidden comment: CAP0402)
C61  value 100nF  [CAPC0402(1005)60_L]  (hidden comment: CAP0402)
C62  value 10uF  [CAPC0805(2012)145_L]  (hidden comment: CAP0805)
C63  value 100nF  [CAPC0402(1005)60_L]  (hidden comment: CAP0402)
C64  value 100nF  [CAPC0402(1005)60_L]  (hidden comment: CAP0402)
C65  value 100nF  [CAPC0402(1005)60_L]  (hidden comment: CAP0402)
C66  value 100nF  [CAPC0402(1005)60_L]  (hidden comment: CAP0402)
C67  value 100nF  [CAPC0402(1005)60_L]  (hidden comment: CAP0402)
C68  value 100nF  [CAPC0402(1005)60_L]  (hidden comment: CAP0402)
C69  value 100nF  [CAPC0402(1005)60_L]  (hidden comment: CAP0402)
C70  value 100nF  [CAPC0402(1005)60_L]  (hidden comment: CAP0402)
R65  value DNP  [RESC0402(1005)_L]  (hidden comment: RES0402)
R66  value 68k  [RESC0402(1005)_L]  (hidden comment: RES0402)
R67  value 68k  [RESC0402(1005)_L]  (hidden comment: RES0402)
R68  value 68k  [RESC0402(1005)_L]  (hidden comment: RES0402)
R69  value 68k  [RESC0402(1005)_L]  (hidden comment: RES0402)
R70  value 68k  [RESC0402(1005)_L]  (hidden comment: RES0402)
R71  value 68k  [RESC0402(1005)_L]  (hidden comment: RES0402)
R72  value 10k  [RESC0402(1005)_L]  (hidden comment: RES0402)
R73  value 100k  [RESC0402(1005)_L]  (hidden comment: RES0402)
R74  value 10k  [RESC0402(1005)_L]  (hidden comment: RES0402)
R75  value 10k  [RESC0402(1005)_L]  (hidden comment: RES0402)
R76  value 10k  [RESC0402(1005)_L]  (hidden comment: RES0402)
R77  value 10k  [RESC0402(1005)_L]  (hidden comment: RES0402)
R78  value 10k  [RESC0402(1005)_L]  (hidden comment: RES0402)
R79  value 10k  [RESC0402(1005)_L]  (hidden comment: RES0402)
R80  value 22k  [RESC0402(1005)_L]  (hidden comment: RES0402)
U5  ADC128D818CIMT/NOPB  [MTC16_N]

### Ports
DIAG_ADC_INT (out), SCL (in), SDA (bidir)

### Nets
3.3V: C60.1 C61.1 R66.1 R72.1 U5.5(V+)
5V: R67.1
5V_ANALOG: R68.1
12V: R71.1
15V: R69.1
-15V: R73.1
GND: C60.2 C61.2 C62.1 C63.2 C64.1 C65.1 C66.1 C67.1 C68.1 C69.1 C70.1 R74.2 R75.2 R76.2 R77.2 R78.2 R79.2 R80.2 U5.4(GND) U5.7(A0) U5.8(A1)
V_REF_4.096: R65.2 R70.1
IN0: C64.2 R66.2 R74.1 U5.16(IN0)
IN1: C65.2 R67.2 R75.1 U5.15(IN1)
IN2: C66.2 R68.2 R76.1 U5.14(IN2)
IN3: C67.2 R69.2 R77.1 U5.13(IN3)
IN4: C68.2 R70.2 R78.1 U5.12(IN4)
IN5: C69.2 R71.2 R79.1 U5.11(IN5)
IN6: C70.2 R72.2 R73.2 R80.1 U5.10(IN6)
IN7: U5.9(IN7)
INPUT1: U5.6(~{INT}) ; port DIAG_ADC_INT
SCL: U5.3(SCL) ; port SCL
SDA: U5.2(SDA) ; port SDA
NetC62_2: C62.2 C63.1 R65.1 U5.1(VREF)

### Notes on the sheet
- voltage dividers for adc

### Library data of the parts
C60 C61 C63-C70 = CMP-1590-00004-1: as C14 on sheet ADC_Sheet; PackageReference: CAPC0402(1005)60
C62 = CMP-1590-00003-1: as C13 on sheet ADC_Sheet; PackageReference: CAPC0805(2012)145
R65-R80 = CMP-1591-00004-1: as R236 on sheet USB; PackageReference: RESC0402(1005)
U5 = CMP-0054-00333-2: 12-Bit, 8-Channel, ADC System Monitor with Temperature Sensor, Internal/External Reference, and I2C Interface, 16 pin TSSOP, Pb-Free; Manufacturer: National Semiconductor; PowerWise: N; PackageTopMarking: NSUZXYTT*128D818*CIMT; CompType: ADC IC; ComponentLink3Description: MTC16 Package Page; RoHS: Y; PackageDescription: Molded TSSOP, Jedec, 5 x 4.4 x 0.9mm Body, 16 Lead, 0.65mm Pitch; PackageVersion: revD, Jun-2003; ComponentLink2Description: ADC128D818 Web Page; DatasheetVersion: Feb-2010; ComponentLink2URL: http://www.national.com/pf/AD/ADC128D818.html; ComponentLink1Description: ADC128D818 Datasheet; Code_JEDEC: MO-153-AB; PinCount: 16; PackageReference: MTC16; ComponentLink3URL: http://www.national.com/packaging/folders/mtc16.html; ComponentLink1URL: http://www.national.com/ds/AD/ADC128D818.pdf; RevisionNote: Component URLs added